# Altium project Drone.PrjPcb
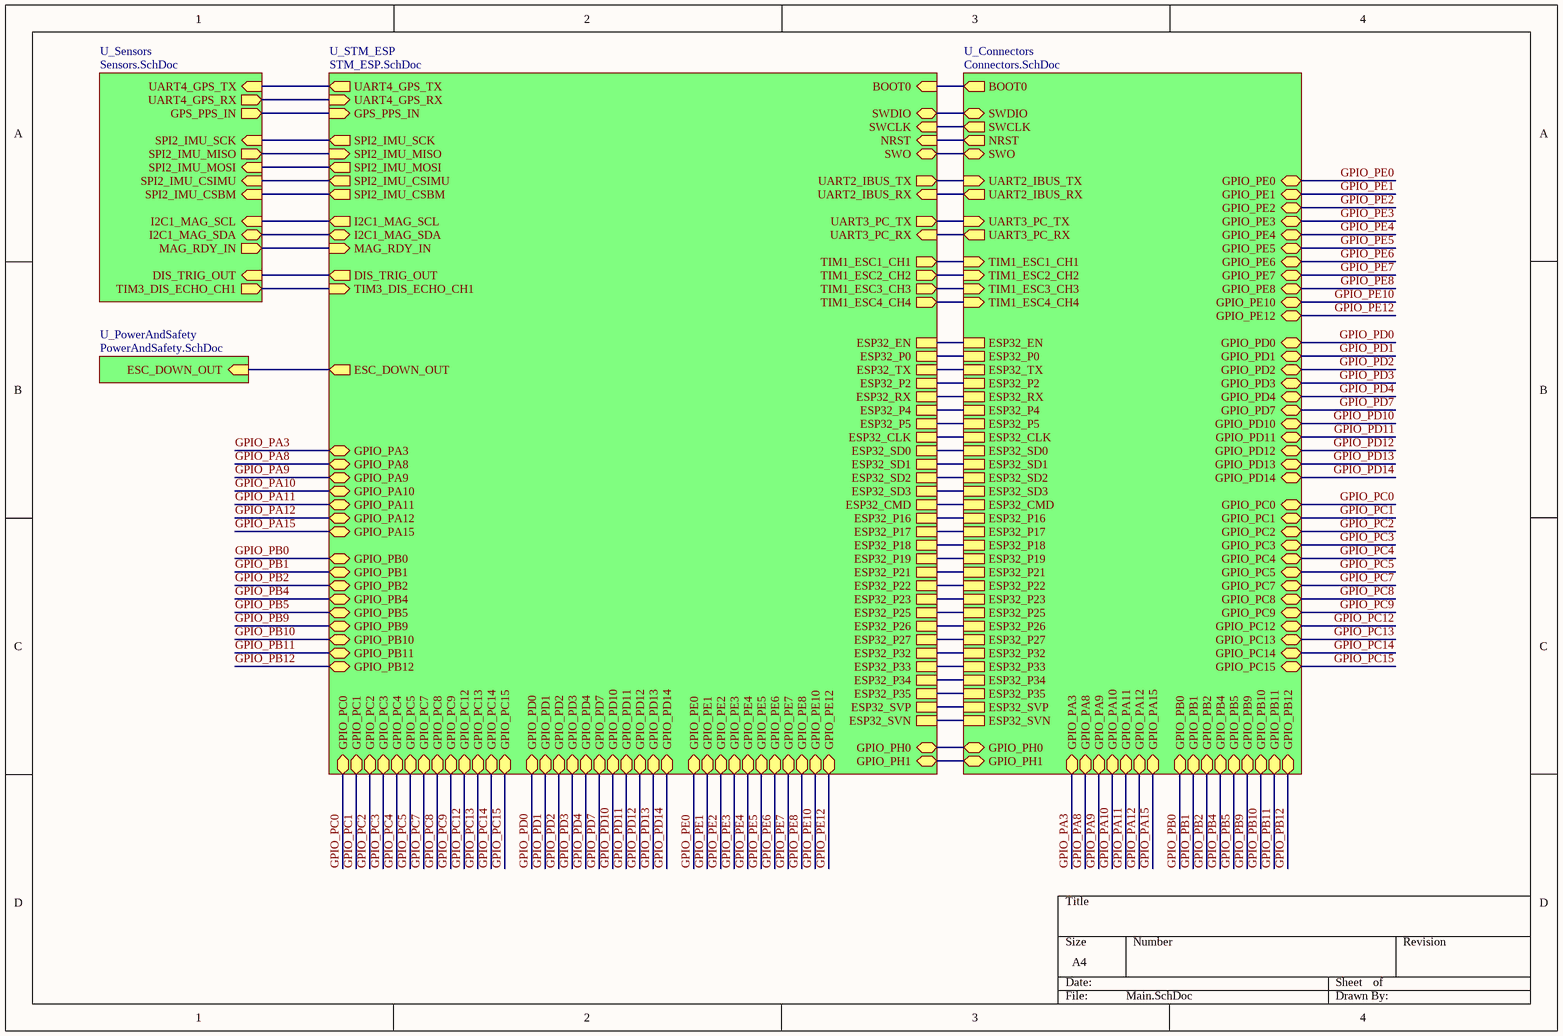
[diagram p0: Main.SchDoc]
5 sheets, 98 parts. Net scope: flat (ports and power ports of the same name join across sheets).
Board file: Main.PcbDoc
Sheets:
  Main.SchDoc
    U_STM_ESP = STM_ESP.SchDoc
    U_Sensors = Sensors.SchDoc
    U_Connectors = Connectors.SchDoc
    U_PowerAndSafety = PowerAndSafety.SchDoc

## Sheet Main.SchDoc
size A4; SheetNumber: 1; SheetTotal: 5

### Sub-sheets
U_Connectors = Connectors.SchDoc: ESP32_EN, ESP32_SVP, ESP32_SVN, ESP32_P34, ESP32_P35, ESP32_P32, ESP32_P33, ESP32_P25, ESP32_P26, ESP32_P27, ESP32_SD2, ESP32_SD3, ESP32_CMD, ESP32_P23, ESP32_P22, ESP32_TX, ESP32_RX, ESP32_P21, ESP32_P19, ESP32_P18, ESP32_P5, ESP32_P17, ESP32_P16, ESP32_P4, ESP32_P0, ESP32_SD1, ESP32_SD0, ESP32_CLK, ESP32_P2, GPIO_PA3 (bidir), GPIO_PA8 (bidir), GPIO_PA11 (bidir), GPIO_PA12 (bidir), GPIO_PA15 (bidir), GPIO_PB0 (bidir), GPIO_PB1 (bidir), GPIO_PB4 (bidir), GPIO_PB5 (bidir), GPIO_PB10 (bidir), GPIO_PC2 (bidir), GPIO_PC3 (bidir), GPIO_PH0 (bidir), GPIO_PH1 (bidir), GPIO_PB9 (bidir), BOOT0 (out), NRST (out), SWO (bidir), TIM1_ESC1_CH1 (in), TIM1_ESC2_CH2 (in), TIM1_ESC3_CH3 (in), TIM1_ESC4_CH4 (in), UART2_IBUS_TX (in), UART2_IBUS_RX (out), GPIO_PA9 (bidir), GPIO_PC15 (bidir), GPIO_PB2 (bidir), GPIO_PB11 (bidir), GPIO_PB12 (bidir), GPIO_PD0 (bidir), GPIO_PD1 (bidir), GPIO_PD2 (bidir), GPIO_PD3 (bidir), GPIO_PD4 (bidir), GPIO_PD7 (bidir), GPIO_PD10 (bidir), GPIO_PD11 (bidir), GPIO_PD12 (bidir), GPIO_PD13 (bidir), GPIO_PD14 (bidir), GPIO_PE0 (bidir), GPIO_PE5 (bidir), GPIO_PE6 (bidir), GPIO_PE7 (bidir), GPIO_PE8 (bidir), GPIO_PE10 (bidir), GPIO_PE12 (bidir), GPIO_PC0 (bidir), GPIO_PC1 (bidir), GPIO_PC4 (bidir), GPIO_PC5 (bidir), GPIO_PC7 (bidir), GPIO_PC8 (bidir), GPIO_PC9 (bidir), GPIO_PC12 (bidir), GPIO_PC13 (bidir), GPIO_PC14 (bidir), GPIO_PE1 (bidir), GPIO_PE2 (bidir), GPIO_PE3 (bidir), GPIO_PE4 (bidir), SWDIO (bidir), SWCLK (out), UART3_PC_TX (in), UART3_PC_RX (out), GPIO_PA10 (bidir)
U_PowerAndSafety = PowerAndSafety.SchDoc: ESC_DOWN_OUT (in)
U_Sensors = Sensors.SchDoc: UART4_GPS_TX (in), UART4_GPS_RX (out), GPS_PPS_IN (out), SPI2_IMU_CSIMU (in), SPI2_IMU_SCK (in), SPI2_IMU_MISO (out), SPI2_IMU_MOSI (in), SPI2_IMU_CSBM (in), I2C1_MAG_SCL (in), I2C1_MAG_SDA (bidir), MAG_RDY_IN (out), DIS_TRIG_OUT (in), TIM3_DIS_ECHO_CH1 (out)
U_STM_ESP = STM_ESP.SchDoc: GPIO_PA3 (bidir), GPIO_PA8 (bidir), GPIO_PB9 (bidir), GPIO_PB10 (bidir), BOOT0 (in), NRST (in), GPIO_PA11 (bidir), GPIO_PA12 (bidir), GPIO_PA15 (bidir), GPIO_PB0 (bidir), GPIO_PB1 (bidir), GPIO_PB4 (bidir), GPIO_PB5 (bidir), GPIO_PC2 (bidir), GPIO_PC3 (bidir), GPIO_PH0 (bidir), GPIO_PH1 (bidir), ESP32_EN, ESP32_SVP, ESP32_SVN, ESP32_P34, ESP32_P35, ESP32_P32, ESP32_P33, ESP32_P25, ESP32_P26, ESP32_P27, ESP32_SD2, ESP32_SD3, ESP32_CMD, ESP32_P23, ESP32_P22, ESP32_TX, ESP32_RX, ESP32_P21, ESP32_P19, ESP32_P18, ESP32_P5, ESP32_P17, ESP32_P16, ESP32_P4, ESP32_P0, ESP32_SD1, ESP32_SD0, ESP32_CLK, ESP32_P2, SWO (bidir), UART4_GPS_TX (out), UART4_GPS_RX (in), I2C1_MAG_SCL (out), I2C1_MAG_SDA (bidir), SPI2_IMU_SCK (out), SPI2_IMU_MISO (in), SPI2_IMU_MOSI (out), GPS_PPS_IN (in), SPI2_IMU_CSIMU (out), SPI2_IMU_CSBM (out), MAG_RDY_IN (in), TIM1_ESC1_CH1 (out), TIM1_ESC2_CH2 (out), TIM1_ESC3_CH3 (out), TIM1_ESC4_CH4 (out), ESC_DOWN_OUT (out), SWDIO (bidir), SWCLK (in), UART3_PC_TX (out), UART3_PC_RX (in), DIS_TRIG_OUT (out), TIM3_DIS_ECHO_CH1 (in), GPIO_PA9 (bidir), GPIO_PA10 (bidir), GPIO_PC0 (bidir), GPIO_PC1 (bidir), GPIO_PC4 (bidir), GPIO_PC5 (bidir), GPIO_PC7 (bidir), GPIO_PC8 (bidir), GPIO_PC9 (bidir), GPIO_PC12 (bidir), GPIO_PC13 (bidir), GPIO_PC14 (bidir), GPIO_PC15 (bidir), GPIO_PB2 (bidir), GPIO_PB11 (bidir), GPIO_PB12 (bidir), GPIO_PD0 (bidir), GPIO_PD1 (bidir), GPIO_PD2 (bidir), GPIO_PD3 (bidir), GPIO_PD4 (bidir), GPIO_PD7 (bidir), GPIO_PD10 (bidir), GPIO_PD11 (bidir), GPIO_PD12 (bidir), GPIO_PD13 (bidir), GPIO_PD14 (bidir), GPIO_PE0 (bidir), GPIO_PE1 (bidir), GPIO_PE2 (bidir), GPIO_PE3 (bidir), GPIO_PE4 (bidir), GPIO_PE5 (bidir), GPIO_PE6 (bidir), GPIO_PE7 (bidir), GPIO_PE8 (bidir), GPIO_PE10 (bidir), GPIO_PE12 (bidir), UART2_IBUS_TX (out), UART2_IBUS_RX (in)

### Nets
GPIO_PA3: sheet U_STM_ESP/GPIO_PA3, sheet U_Connectors/GPIO_PA3
GPIO_PA8: sheet U_STM_ESP/GPIO_PA8, sheet U_Connectors/GPIO_PA8
GPIO_PA9: sheet U_STM_ESP/GPIO_PA9, sheet U_Connectors/GPIO_PA9
GPIO_PA10: sheet U_STM_ESP/GPIO_PA10, sheet U_Connectors/GPIO_PA10
GPIO_PA11: sheet U_STM_ESP/GPIO_PA11, sheet U_Connectors/GPIO_PA11
GPIO_PA12: sheet U_STM_ESP/GPIO_PA12, sheet U_Connectors/GPIO_PA12
GPIO_PA15: sheet U_STM_ESP/GPIO_PA15, sheet U_Connectors/GPIO_PA15
GPIO_PB0: sheet U_STM_ESP/GPIO_PB0, sheet U_Connectors/GPIO_PB0
GPIO_PB1: sheet U_STM_ESP/GPIO_PB1, sheet U_Connectors/GPIO_PB1
GPIO_PB2: sheet U_STM_ESP/GPIO_PB2, sheet U_Connectors/GPIO_PB2
GPIO_PB4: sheet U_STM_ESP/GPIO_PB4, sheet U_Connectors/GPIO_PB4
GPIO_PB5: sheet U_STM_ESP/GPIO_PB5, sheet U_Connectors/GPIO_PB5
GPIO_PB9: sheet U_STM_ESP/GPIO_PB9, sheet U_Connectors/GPIO_PB9
GPIO_PB10: sheet U_STM_ESP/GPIO_PB10, sheet U_Connectors/GPIO_PB10
GPIO_PB11: sheet U_STM_ESP/GPIO_PB11, sheet U_Connectors/GPIO_PB11
GPIO_PB12: sheet U_STM_ESP/GPIO_PB12, sheet U_Connectors/GPIO_PB12
GPIO_PC0: sheet U_STM_ESP/GPIO_PC0, sheet U_Connectors/GPIO_PC0
GPIO_PC1: sheet U_STM_ESP/GPIO_PC1, sheet U_Connectors/GPIO_PC1
GPIO_PC2: sheet U_STM_ESP/GPIO_PC2, sheet U_Connectors/GPIO_PC2
GPIO_PC3: sheet U_STM_ESP/GPIO_PC3, sheet U_Connectors/GPIO_PC3
GPIO_PC4: sheet U_STM_ESP/GPIO_PC4, sheet U_Connectors/GPIO_PC4
GPIO_PC5: sheet U_STM_ESP/GPIO_PC5, sheet U_Connectors/GPIO_PC5
GPIO_PC7: sheet U_STM_ESP/GPIO_PC7, sheet U_Connectors/GPIO_PC7
GPIO_PC8: sheet U_STM_ESP/GPIO_PC8, sheet U_Connectors/GPIO_PC8
GPIO_PC9: sheet U_STM_ESP/GPIO_PC9, sheet U_Connectors/GPIO_PC9
GPIO_PC12: sheet U_STM_ESP/GPIO_PC12, sheet U_Connectors/GPIO_PC12
GPIO_PC13: sheet U_STM_ESP/GPIO_PC13, sheet U_Connectors/GPIO_PC13
GPIO_PC14: sheet U_STM_ESP/GPIO_PC14, sheet U_Connectors/GPIO_PC14
GPIO_PC15: sheet U_STM_ESP/GPIO_PC15, sheet U_Connectors/GPIO_PC15
GPIO_PD0: sheet U_STM_ESP/GPIO_PD0, sheet U_Connectors/GPIO_PD0
GPIO_PD1: sheet U_STM_ESP/GPIO_PD1, sheet U_Connectors/GPIO_PD1
GPIO_PD2: sheet U_STM_ESP/GPIO_PD2, sheet U_Connectors/GPIO_PD2
GPIO_PD3: sheet U_STM_ESP/GPIO_PD3, sheet U_Connectors/GPIO_PD3
GPIO_PD4: sheet U_STM_ESP/GPIO_PD4, sheet U_Connectors/GPIO_PD4
GPIO_PD7: sheet U_STM_ESP/GPIO_PD7, sheet U_Connectors/GPIO_PD7
GPIO_PD10: sheet U_STM_ESP/GPIO_PD10, sheet U_Connectors/GPIO_PD10
GPIO_PD11: sheet U_STM_ESP/GPIO_PD11, sheet U_Connectors/GPIO_PD11
GPIO_PD12: sheet U_STM_ESP/GPIO_PD12, sheet U_Connectors/GPIO_PD12
GPIO_PD13: sheet U_STM_ESP/GPIO_PD13, sheet U_Connectors/GPIO_PD13
GPIO_PD14: sheet U_STM_ESP/GPIO_PD14, sheet U_Connectors/GPIO_PD14
GPIO_PE0: sheet U_STM_ESP/GPIO_PE0, sheet U_Connectors/GPIO_PE0
GPIO_PE1: sheet U_STM_ESP/GPIO_PE1, sheet U_Connectors/GPIO_PE1
GPIO_PE2: sheet U_STM_ESP/GPIO_PE2, sheet U_Connectors/GPIO_PE2
GPIO_PE3: sheet U_STM_ESP/GPIO_PE3, sheet U_Connectors/GPIO_PE3
GPIO_PE4: sheet U_STM_ESP/GPIO_PE4, sheet U_Connectors/GPIO_PE4
GPIO_PE5: sheet U_STM_ESP/GPIO_PE5, sheet U_Connectors/GPIO_PE5
GPIO_PE6: sheet U_STM_ESP/GPIO_PE6, sheet U_Connectors/GPIO_PE6
GPIO_PE7: sheet U_STM_ESP/GPIO_PE7, sheet U_Connectors/GPIO_PE7
GPIO_PE8: sheet U_STM_ESP/GPIO_PE8, sheet U_Connectors/GPIO_PE8
GPIO_PE10: sheet U_STM_ESP/GPIO_PE10, sheet U_Connectors/GPIO_PE10
GPIO_PE12: sheet U_STM_ESP/GPIO_PE12, sheet U_Connectors/GPIO_PE12
(unnamed): sheet U_STM_ESP/BOOT0, sheet U_Connectors/BOOT0
(unnamed): sheet U_STM_ESP/NRST, sheet U_Connectors/NRST
(unnamed): sheet U_STM_ESP/GPIO_PH0, sheet U_Connectors/GPIO_PH0
(unnamed): sheet U_STM_ESP/GPIO_PH1, sheet U_Connectors/GPIO_PH1
(unnamed): sheet U_STM_ESP/ESP32_EN, sheet U_Connectors/ESP32_EN
(unnamed): sheet U_STM_ESP/ESP32_SVP, sheet U_Connectors/ESP32_SVP
(unnamed): sheet U_STM_ESP/ESP32_SVN, sheet U_Connectors/ESP32_SVN
(unnamed): sheet U_STM_ESP/ESP32_P34, sheet U_Connectors/ESP32_P34
(unnamed): sheet U_STM_ESP/ESP32_P35, sheet U_Connectors/ESP32_P35
(unnamed): sheet U_STM_ESP/ESP32_P32, sheet U_Connectors/ESP32_P32
(unnamed): sheet U_STM_ESP/ESP32_P33, sheet U_Connectors/ESP32_P33
(unnamed): sheet U_STM_ESP/ESP32_P25, sheet U_Connectors/ESP32_P25
(unnamed): sheet U_STM_ESP/ESP32_P26, sheet U_Connectors/ESP32_P26
(unnamed): sheet U_STM_ESP/ESP32_P27, sheet U_Connectors/ESP32_P27
(unnamed): sheet U_STM_ESP/ESP32_SD2, sheet U_Connectors/ESP32_SD2
(unnamed): sheet U_STM_ESP/ESP32_SD3, sheet U_Connectors/ESP32_SD3
(unnamed): sheet U_STM_ESP/ESP32_CMD, sheet U_Connectors/ESP32_CMD
(unnamed): sheet U_STM_ESP/ESP32_P23, sheet U_Connectors/ESP32_P23
(unnamed): sheet U_STM_ESP/ESP32_P22, sheet U_Connectors/ESP32_P22
(unnamed): sheet U_STM_ESP/ESP32_TX, sheet U_Connectors/ESP32_TX
(unnamed): sheet U_STM_ESP/ESP32_RX, sheet U_Connectors/ESP32_RX
(unnamed): sheet U_STM_ESP/ESP32_P21, sheet U_Connectors/ESP32_P21
(unnamed): sheet U_STM_ESP/ESP32_P19, sheet U_Connectors/ESP32_P19
(unnamed): sheet U_STM_ESP/ESP32_P18, sheet U_Connectors/ESP32_P18
(unnamed): sheet U_STM_ESP/ESP32_P5, sheet U_Connectors/ESP32_P5
(unnamed): sheet U_STM_ESP/ESP32_P17, sheet U_Connectors/ESP32_P17
(unnamed): sheet U_STM_ESP/ESP32_P16, sheet U_Connectors/ESP32_P16
(unnamed): sheet U_STM_ESP/ESP32_P4, sheet U_Connectors/ESP32_P4
(unnamed): sheet U_STM_ESP/ESP32_P0, sheet U_Connectors/ESP32_P0
(unnamed): sheet U_STM_ESP/ESP32_SD1, sheet U_Connectors/ESP32_SD1
(unnamed): sheet U_STM_ESP/ESP32_SD0, sheet U_Connectors/ESP32_SD0
(unnamed): sheet U_STM_ESP/ESP32_CLK, sheet U_Connectors/ESP32_CLK
(unnamed): sheet U_STM_ESP/ESP32_P2, sheet U_Connectors/ESP32_P2
(unnamed): sheet U_STM_ESP/SWO, sheet U_Connectors/SWO
(unnamed): sheet U_STM_ESP/UART4_GPS_TX, sheet U_Sensors/UART4_GPS_TX
(unnamed): sheet U_STM_ESP/UART4_GPS_RX, sheet U_Sensors/UART4_GPS_RX
(unnamed): sheet U_STM_ESP/I2C1_MAG_SCL, sheet U_Sensors/I2C1_MAG_SCL
(unnamed): sheet U_STM_ESP/I2C1_MAG_SDA, sheet U_Sensors/I2C1_MAG_SDA
(unnamed): sheet U_STM_ESP/SPI2_IMU_SCK, sheet U_Sensors/SPI2_IMU_SCK
(unnamed): sheet U_STM_ESP/SPI2_IMU_MISO, sheet U_Sensors/SPI2_IMU_MISO
(unnamed): sheet U_STM_ESP/SPI2_IMU_MOSI, sheet U_Sensors/SPI2_IMU_MOSI
(unnamed): sheet U_STM_ESP/GPS_PPS_IN, sheet U_Sensors/GPS_PPS_IN
(unnamed): sheet U_STM_ESP/SPI2_IMU_CSIMU, sheet U_Sensors/SPI2_IMU_CSIMU
(unnamed): sheet U_STM_ESP/SPI2_IMU_CSBM, sheet U_Sensors/SPI2_IMU_CSBM
(unnamed): sheet U_STM_ESP/MAG_RDY_IN, sheet U_Sensors/MAG_RDY_IN
(unnamed): sheet U_STM_ESP/TIM1_ESC1_CH1, sheet U_Connectors/TIM1_ESC1_CH1
(unnamed): sheet U_STM_ESP/TIM1_ESC2_CH2, sheet U_Connectors/TIM1_ESC2_CH2
(unnamed): sheet U_STM_ESP/TIM1_ESC3_CH3, sheet U_Connectors/TIM1_ESC3_CH3
(unnamed): sheet U_STM_ESP/TIM1_ESC4_CH4, sheet U_Connectors/TIM1_ESC4_CH4
(unnamed): sheet U_STM_ESP/ESC_DOWN_OUT, sheet U_PowerAndSafety/ESC_DOWN_OUT
(unnamed): sheet U_STM_ESP/SWDIO, sheet U_Connectors/SWDIO
(unnamed): sheet U_STM_ESP/SWCLK, sheet U_Connectors/SWCLK
(unnamed): sheet U_STM_ESP/UART3_PC_TX, sheet U_Connectors/UART3_PC_TX
(unnamed): sheet U_STM_ESP/UART3_PC_RX, sheet U_Connectors/UART3_PC_RX
(unnamed): sheet U_STM_ESP/DIS_TRIG_OUT, sheet U_Sensors/DIS_TRIG_OUT
(unnamed): sheet U_STM_ESP/TIM3_DIS_ECHO_CH1, sheet U_Sensors/TIM3_DIS_ECHO_CH1
(unnamed): sheet U_STM_ESP/UART2_IBUS_TX, sheet U_Connectors/UART2_IBUS_TX
(unnamed): sheet U_STM_ESP/UART2_IBUS_RX, sheet U_Connectors/UART2_IBUS_RX

## Sheet STM_ESP.SchDoc
size A4; SheetNumber: 2; SheetTotal: 5
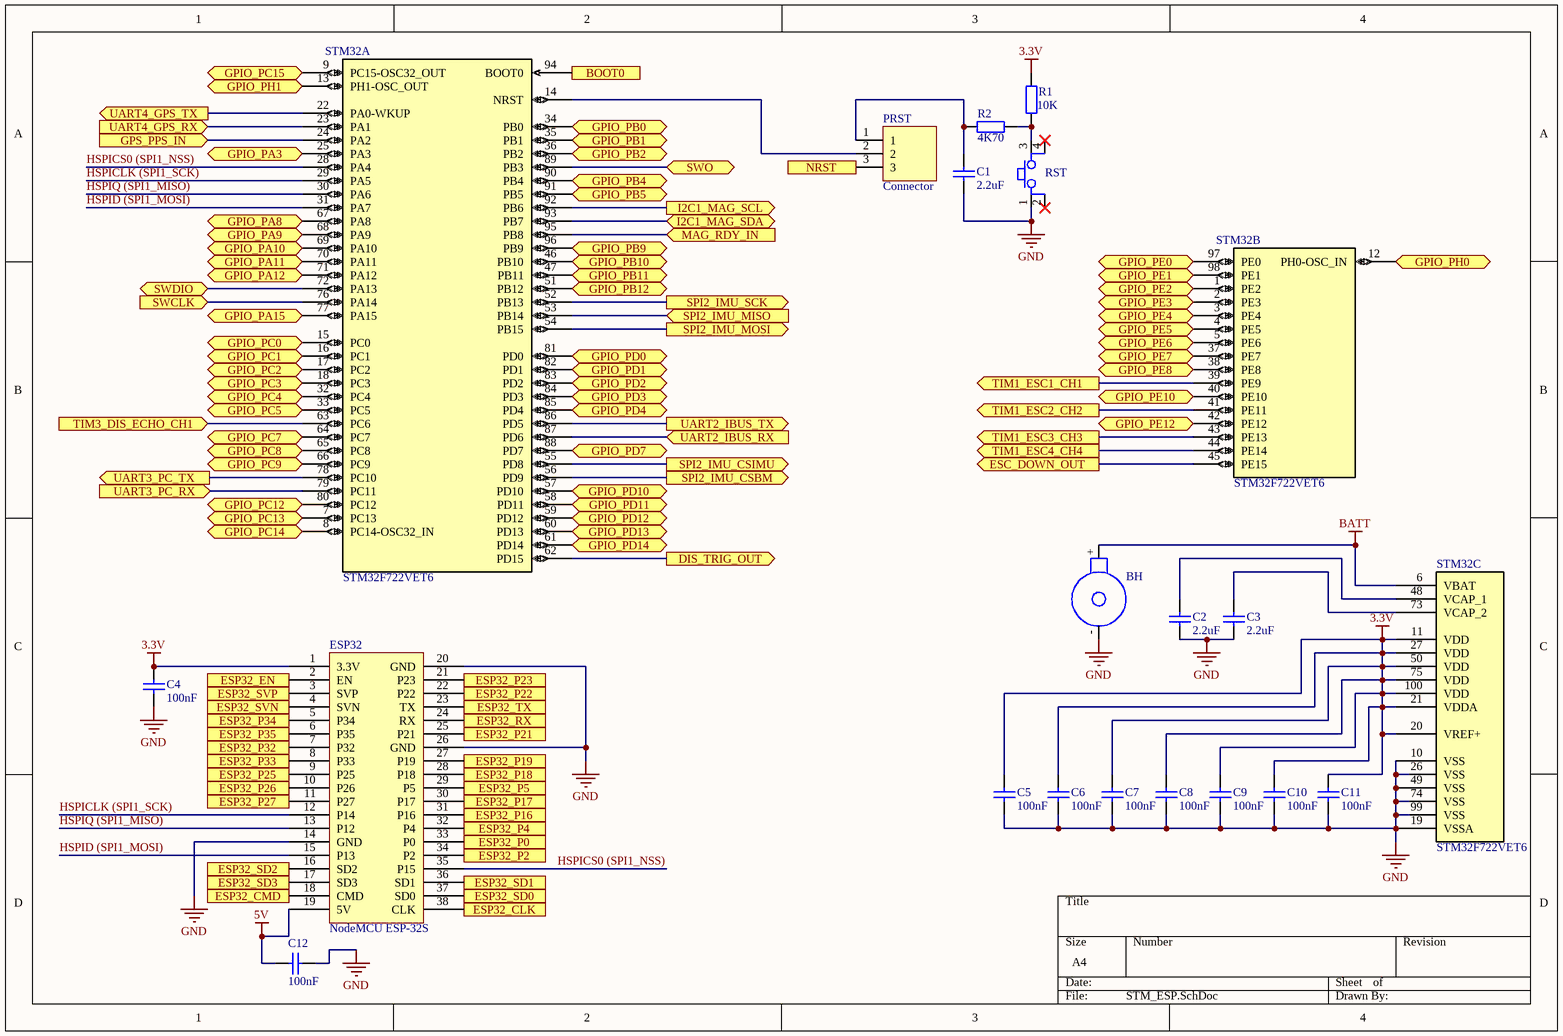
[diagram p1: STM_ESP.SchDoc]

### Parts
BH  Battery Holder  [ONLAB_ELEMTARTO]  (value not drawn)
C1  2.2uF  [FP_0805_CAP_085]
C2  2.2uF  [FP_0805_CAP_085]
C3  2.2uF  [FP_0805_CAP_085]
C4  100nF  [FP_0805_CAP_085]
C5  100nF  [FP_0805_CAP_085]
C6  100nF  [FP_0805_CAP_085]
C7  100nF  [FP_0805_CAP_085]
C8  100nF  [FP_0805_CAP_085]
C9  100nF  [FP_0805_CAP_085]
C10  100nF  [FP_0805_CAP_085]
C11  100nF  [FP_0805_CAP_085]
C12  100nF  [FP_0805_CAP_085]
ESP32  NodeMCU ESP-32S  [ESP32_NODEMCU-32S]
PRST  Connector  [FP_CONN3_TUSKE_254MM]
R1  10K  [FP_0805_RES]
R2  4K70  [FP_0805_RES]
RST  Button  [FP_BTN_SMD]  (value not drawn)
STM32  STM32F722VET6  [LQFP100-14x14mm]  (parts A,B,C of 3)

### Ports
BOOT0 (in), DIS_TRIG_OUT (out), ESC_DOWN_OUT (out), ESP32_CLK, ESP32_CMD, ESP32_EN, ESP32_P0, ESP32_P2, ESP32_P4, ESP32_P5, ESP32_P16, ESP32_P17, ESP32_P18, ESP32_P19, ESP32_P21, ESP32_P22, ESP32_P23, ESP32_P25, ESP32_P26, ESP32_P27, ESP32_P32, ESP32_P33, ESP32_P34, ESP32_P35, ESP32_RX, ESP32_SD0, ESP32_SD1, ESP32_SD2, ESP32_SD3, ESP32_SVN, ESP32_SVP, ESP32_TX, GPIO_PA3 (bidir), GPIO_PA8 (bidir), GPIO_PA9 (bidir), GPIO_PA10 (bidir), GPIO_PA11 (bidir), GPIO_PA12 (bidir), GPIO_PA15 (bidir), GPIO_PB0 (bidir), GPIO_PB1 (bidir), GPIO_PB2 (bidir), GPIO_PB4 (bidir), GPIO_PB5 (bidir), GPIO_PB9 (bidir), GPIO_PB10 (bidir), GPIO_PB11 (bidir), GPIO_PB12 (bidir), GPIO_PC0 (bidir), GPIO_PC1 (bidir), GPIO_PC2 (bidir), GPIO_PC3 (bidir), GPIO_PC4 (bidir), GPIO_PC5 (bidir), GPIO_PC7 (bidir), GPIO_PC8 (bidir), GPIO_PC9 (bidir), GPIO_PC12 (bidir), GPIO_PC13 (bidir), GPIO_PC14 (bidir), GPIO_PC15 (bidir), GPIO_PD0 (bidir), GPIO_PD1 (bidir), GPIO_PD2 (bidir), GPIO_PD3 (bidir), GPIO_PD4 (bidir), GPIO_PD7 (bidir), GPIO_PD10 (bidir), GPIO_PD11 (bidir), GPIO_PD12 (bidir), GPIO_PD13 (bidir), GPIO_PD14 (bidir), GPIO_PE0 (bidir), GPIO_PE1 (bidir), GPIO_PE2 (bidir), GPIO_PE3 (bidir), GPIO_PE4 (bidir), GPIO_PE5 (bidir), GPIO_PE6 (bidir), GPIO_PE7 (bidir), GPIO_PE8 (bidir), GPIO_PE10 (bidir), GPIO_PE12 (bidir), GPIO_PH0 (bidir), GPIO_PH1 (bidir), GPS_PPS_IN (in), I2C1_MAG_SCL (out), I2C1_MAG_SDA (bidir), MAG_RDY_IN (in), NRST (in), SPI2_IMU_CSBM (out), SPI2_IMU_CSIMU (out), SPI2_IMU_MISO (in), SPI2_IMU_MOSI (out), SPI2_IMU_SCK (out), SWCLK (in), SWDIO (bidir), SWO (bidir), TIM1_ESC1_CH1 (out), TIM1_ESC2_CH2 (out), TIM1_ESC3_CH3 (out), TIM1_ESC4_CH4 (out), TIM3_DIS_ECHO_CH1 (in), UART2_IBUS_RX (in), UART2_IBUS_TX (out), UART3_PC_RX (in), UART3_PC_TX (out), UART4_GPS_RX (in), UART4_GPS_TX (out)

### Nets
3.3V: C4.2 C5.1 C6.1 C7.1 C8.1 C9.1 C10.1 C11.1 ESP32.1(3.3V) R1.2 STM32.11(VDD) STM32.20(VREF+) STM32.21(VDDA) STM32.27(VDD) STM32.50(VDD) STM32.75(VDD) STM32.100(VDD)
5V: C12.2 ESP32.19(5V)
BATT: BH.+ STM32.6(VBAT)
GND: BH.- C1.1 C2.1 C3.1 C4.1 C5.2 C6.2 C7.2 C8.2 C9.2 C10.2 C11.2 C12.1 ESP32.14(GND) ESP32.20(GND) ESP32.26(GND) RST.1 STM32.10(VSS) STM32.19(VSSA) STM32.26(VSS) STM32.49(VSS) STM32.74(VSS) STM32.99(VSS)
HSPICLK (SPI1_SCK): ESP32.12(P14) STM32.29(PA5)
HSPICS0 (SPI1_NSS): ESP32.35(P15) STM32.28(PA4)
HSPID (SPI1_MOSI): ESP32.15(P13) STM32.31(PA7)
HSPIQ (SPI1_MISO): ESP32.13(P12) STM32.30(PA6)
NRST: PRST.3 ; port NRST
SWCLK: STM32.76(PA14) ; port SWCLK
SWDIO: STM32.72(PA13) ; port SWDIO
SWO: STM32.89(PB3) ; port SWO
UART3_PC_RX: STM32.79(PC11) ; port UART3_PC_RX
UART3_PC_TX: STM32.78(PC10) ; port UART3_PC_TX
NetC1_2: C1.2 PRST.1 R2.1
NetC2_2: C2.2 STM32.48(VCAP_1)
NetC3_2: C3.2 STM32.73(VCAP_2)
NetESC1_3: STM32.39(PE9) ; port TIM1_ESC1_CH1
NetESC2_3: STM32.41(PE11) ; port TIM1_ESC2_CH2
NetESC3_3: STM32.43(PE13) ; port TIM1_ESC3_CH3
NetESC4_3: STM32.44(PE14) ; port TIM1_ESC4_CH4
NetESP32_2: ESP32.2(EN) ; port ESP32_EN
NetESP32_3: ESP32.3(SVP) ; port ESP32_SVP
NetESP32_4: ESP32.4(SVN) ; port ESP32_SVN
NetESP32_5: ESP32.5(P34) ; port ESP32_P34
NetESP32_6: ESP32.6(P35) ; port ESP32_P35
NetESP32_7: ESP32.7(P32) ; port ESP32_P32
NetESP32_8: ESP32.8(P33) ; port ESP32_P33
NetESP32_9: ESP32.9(P25) ; port ESP32_P25
NetESP32_10: ESP32.10(P26) ; port ESP32_P26
NetESP32_11: ESP32.11(P27) ; port ESP32_P27
NetESP32_16: ESP32.16(SD2) ; port ESP32_SD2
NetESP32_17: ESP32.17(SD3) ; port ESP32_SD3
NetESP32_18: ESP32.18(CMD) ; port ESP32_CMD
NetESP32_21: ESP32.21(P23) ; port ESP32_P23
NetESP32_22: ESP32.22(P22) ; port ESP32_P22
NetESP32_23: ESP32.23(TX) ; port ESP32_TX
NetESP32_24: ESP32.24(RX) ; port ESP32_RX
NetESP32_25: ESP32.25(P21) ; port ESP32_P21
NetESP32_27: ESP32.27(P19) ; port ESP32_P19
NetESP32_28: ESP32.28(P18) ; port ESP32_P18
NetESP32_29: ESP32.29(P5) ; port ESP32_P5
NetESP32_30: ESP32.30(P17) ; port ESP32_P17
NetESP32_31: ESP32.31(P16) ; port ESP32_P16
NetESP32_32: ESP32.32(P4) ; port ESP32_P4
NetESP32_33: ESP32.33(P0) ; port ESP32_P0
NetESP32_34: ESP32.34(P2) ; port ESP32_P2
NetESP32_36: ESP32.36(SD1) ; port ESP32_SD1
NetESP32_37: ESP32.37(SD0) ; port ESP32_SD0
NetESP32_38: ESP32.38(CLK) ; port ESP32_CLK
NetGPS_3: STM32.22(PA0-WKUP) ; port UART4_GPS_TX
NetGPS_4: STM32.23(PA1) ; port UART4_GPS_RX
NetGPS_5: STM32.24(PA2) ; port GPS_PPS_IN
NetIMU_4: STM32.52(PB13) ; port SPI2_IMU_SCK
NetIMU_5: STM32.54(PB15) ; port SPI2_IMU_MOSI
NetIMU_6: STM32.53(PB14) ; port SPI2_IMU_MISO
NetIMU_7: STM32.55(PD8) ; port SPI2_IMU_CSIMU
NetIMU_8: STM32.56(PD9) ; port SPI2_IMU_CSBM
NetLC_3: STM32.62(PD15) ; port DIS_TRIG_OUT
NetLC_4: STM32.63(PC6) ; port TIM3_DIS_ECHO_CH1
NetMAG_3: STM32.92(PB6) ; port I2C1_MAG_SCL
NetMAG_4: STM32.93(PB7) ; port I2C1_MAG_SDA
NetMAG_5: STM32.95(PB8) ; port MAG_RDY_IN
NetPA1_1: STM32.25(PA3) ; port GPIO_PA3
NetPA1_2: STM32.67(PA8) ; port GPIO_PA8
NetPA1_3: STM32.68(PA9) ; port GPIO_PA9
NetPA1_4: STM32.69(PA10) ; port GPIO_PA10
NetPB1_1: STM32.70(PA11) ; port GPIO_PA11
NetPB1_2: STM32.71(PA12) ; port GPIO_PA12
NetPB1_3: STM32.77(PA15) ; port GPIO_PA15
NetPB1_4: STM32.34(PB0) ; port GPIO_PB0
NetPB2_1: STM32.35(PB1) ; port GPIO_PB1
NetPB2_2: STM32.36(PB2) ; port GPIO_PB2
NetPB2_3: STM32.90(PB4) ; port GPIO_PB4
NetPB2_4: STM32.91(PB5) ; port GPIO_PB5
NetPB3_1: STM32.96(PB9) ; port GPIO_PB9
NetPB3_2: STM32.46(PB10) ; port GPIO_PB10
NetPB3_3: STM32.47(PB11) ; port GPIO_PB11
NetPB3_4: STM32.51(PB12) ; port GPIO_PB12
NetPC1_1: STM32.15(PC0) ; port GPIO_PC0
NetPC1_2: STM32.16(PC1) ; port GPIO_PC1
NetPC1_3: STM32.17(PC2) ; port GPIO_PC2
NetPC1_4: STM32.18(PC3) ; port GPIO_PC3
NetPC2_1: STM32.32(PC4) ; port GPIO_PC4
NetPC2_2: STM32.33(PC5) ; port GPIO_PC5
NetPC2_3: STM32.64(PC7) ; port GPIO_PC7
NetPC2_4: STM32.65(PC8) ; port GPIO_PC8
NetPC3_1: STM32.66(PC9) ; port GPIO_PC9
NetPC3_2: STM32.80(PC12) ; port GPIO_PC12
NetPC3_3: STM32.7(PC13) ; port GPIO_PC13
NetPC3_4: STM32.8(PC14-OSC32_IN) ; port GPIO_PC14
NetPD1_1: STM32.9(PC15-OSC32_OUT) ; port GPIO_PC15
NetPD1_2: STM32.81(PD0) ; port GPIO_PD0
NetPD1_3: STM32.82(PD1) ; port GPIO_PD1
NetPD1_4: STM32.83(PD2) ; port GPIO_PD2
NetPD2_1: STM32.84(PD3) ; port GPIO_PD3
NetPD2_2: STM32.85(PD4) ; port GPIO_PD4
NetPD2_3: STM32.88(PD7) ; port GPIO_PD7
NetPD2_4: STM32.57(PD10) ; port GPIO_PD10
NetPD3_1: STM32.58(PD11) ; port GPIO_PD11
NetPD3_2: STM32.59(PD12) ; port GPIO_PD12
NetPD3_3: STM32.60(PD13) ; port GPIO_PD13
NetPD3_4: STM32.61(PD14) ; port GPIO_PD14
NetPE1_1: STM32.97(PE0) ; port GPIO_PE0
NetPE1_2: STM32.98(PE1) ; port GPIO_PE1
NetPE1_3: STM32.1(PE2) ; port GPIO_PE2
NetPE1_4: STM32.2(PE3) ; port GPIO_PE3
NetPE2_1: STM32.3(PE4) ; port GPIO_PE4
NetPE2_2: STM32.4(PE5) ; port GPIO_PE5
NetPE2_3: STM32.5(PE6) ; port GPIO_PE6
NetPE2_4: STM32.37(PE7) ; port GPIO_PE7
NetPE3_1: STM32.38(PE8) ; port GPIO_PE8
NetPE3_2: STM32.40(PE10) ; port GPIO_PE10
NetPE3_3: STM32.42(PE12) ; port GPIO_PE12
NetPH1_1: STM32.12(PH0-OSC_IN) ; port GPIO_PH0
NetPH1_2: STM32.13(PH1-OSC_OUT) ; port GPIO_PH1
NetPRST_2: PRST.2 STM32.14(NRST)
NetR1_1: R1.1 R2.2 RST.3
NetR3_2: STM32.94(BOOT0) ; port BOOT0
NetR9_2: STM32.45(PE15) ; port ESC_DOWN_OUT
NetSENS_3: STM32.86(PD5) ; port UART2_IBUS_TX
NetSERV_3: STM32.87(PD6) ; port UART2_IBUS_RX

Not connected (* = marked no-connect by the designer): RST 2* 4*

### Library data of the parts
BH = Battery Holder: ELEMTARTÓ 1x2032 BH2032-3P (T-T) NYÁK FEKVŐ /CR2032/
C1-C12 = CAP: Capacitor
  C1-C3: Value: 2.2uF
  C4-C12: Value: 100nF
ESP32 = NodeMCU ESP-32S: NodeMCU ESP32 Wireless & / Bluetooth Development Board
PRST = Connector_3pin: 3pin connector
R1 R2 = RES: Resistor
  R1: Value: 10K
  R2: Value: 4K70
RST = Button 4P: Push button
STM32 = STM32F722VET6: No Description Available; Mfr_Name: STMicroelectronics; RefDes: RefDes; Type: Type

## Sheet Sensors.SchDoc
size A4; SheetNumber: 3; SheetTotal: 5
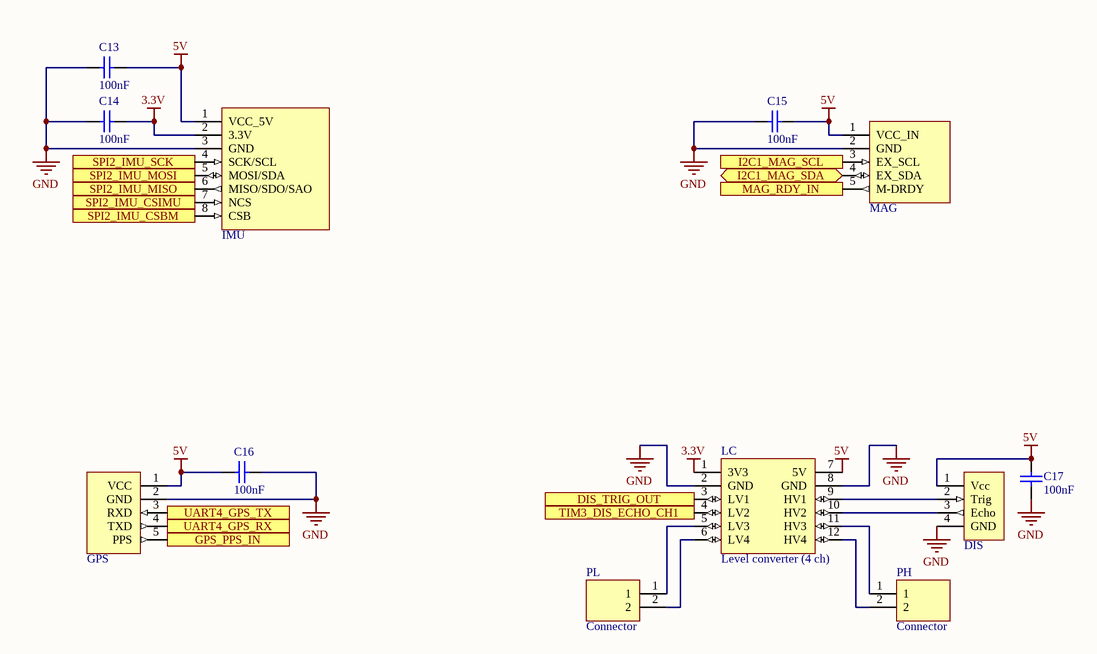
[diagram p2: Sensors.SchDoc]

### Parts
C13  100nF  [FP_0805_CAP_085]
C14  100nF  [FP_0805_CAP_085]
C15  100nF  [FP_0805_CAP_085]
C16  100nF  [FP_0805_CAP_085]
C17  100nF  [FP_0805_CAP_085]
DIS  Távolságérzékelő  [FP_CONN4_TUSKE_254MM]  (value not drawn)
GPS  GPS  [FP_CONN5_TUSKE_254MM]  (value not drawn)
IMU  IMU + Barométer  [GY-91]  (value not drawn)
LC  Level converter (4 ch)  [Level converter (4 ch)]
MAG  Iránytű, magnetométer  [GY-271]  (value not drawn)
PH  Connector  [FP_CONN2_TUSKE_254MM]
PL  Connector  [FP_CONN2_TUSKE_254MM]

### Ports
DIS_TRIG_OUT (in), GPS_PPS_IN (out), I2C1_MAG_SCL (in), I2C1_MAG_SDA (bidir), MAG_RDY_IN (out), SPI2_IMU_CSBM (in), SPI2_IMU_CSIMU (in), SPI2_IMU_MISO (out), SPI2_IMU_MOSI (in), SPI2_IMU_SCK (in), TIM3_DIS_ECHO_CH1 (out), UART4_GPS_RX (out), UART4_GPS_TX (in)

### Nets
3.3V: C14.2 IMU.2(3.3V) LC.1(3V3)
5V: C13.2 C15.2 C16.1 C17.2 DIS.1(Vcc) GPS.1(VCC) IMU.1(VCC_5V) LC.7(5V) MAG.1(VCC_IN)
GND: C13.1 C14.1 C15.1 C16.2 C17.1 DIS.4(GND) GPS.2(GND) IMU.3(GND) LC.2(GND) LC.8(GND) MAG.2(GND)
NetDIS_2: DIS.2(Trig) LC.9(HV1)
NetDIS_3: DIS.3(Echo) LC.10(HV2)
NetGPS_3: GPS.3(RXD) ; port UART4_GPS_TX
NetGPS_4: GPS.4(TXD) ; port UART4_GPS_RX
NetGPS_5: GPS.5(PPS) ; port GPS_PPS_IN
NetIMU_4: IMU.4(SCK/SCL) ; port SPI2_IMU_SCK
NetIMU_5: IMU.5(MOSI/SDA) ; port SPI2_IMU_MOSI
NetIMU_6: IMU.6(MISO/SDO/SAO) ; port SPI2_IMU_MISO
NetIMU_7: IMU.7(NCS) ; port SPI2_IMU_CSIMU
NetIMU_8: IMU.8(CSB) ; port SPI2_IMU_CSBM
NetLC_3: LC.3(LV1) ; port DIS_TRIG_OUT
NetLC_4: LC.4(LV2) ; port TIM3_DIS_ECHO_CH1
NetLC_5: LC.5(LV3) PL.1
NetLC_6: LC.6(LV4) PL.2
NetLC_11: LC.11(HV3) PH.1
NetLC_12: LC.12(HV4) PH.2
NetMAG_3: MAG.3(EX_SCL) ; port I2C1_MAG_SCL
NetMAG_4: MAG.4(EX_SDA) ; port I2C1_MAG_SDA
NetMAG_5: MAG.5(M-DRDY) ; port MAG_RDY_IN

### Library data of the parts
C13-C17 = CAP: Capacitor; Value: 100nF
DIS = HC-SR04-4P: Ultrahangos távolságérzékelő modul, 4P
GPS = NEO-7M-0-000: Ublox GPS modul EEPROM-mal C / AeroQuad-hoz, antennával NEO-7M 7N APM2.5 repülésvezérléshez
IMU = GY-91: 9DOF MPU9250 modul + BMP280, giroszkóp, gyorsulásmérő, iránytű, nyomásmérő, hőmérő, páratartalom mérő
LC = Level converter (4 ch): 4 channel level converter 3.3 <-> 5 V
MAG = GY-271: HMC5883L 3 tengelyes digitális iránytű (compass, magnetometer) I2C
PH PL = Connector_2pin: 2pin connector

## Sheet Connectors.SchDoc
size A4; SheetNumber: 4; SheetTotal: 5
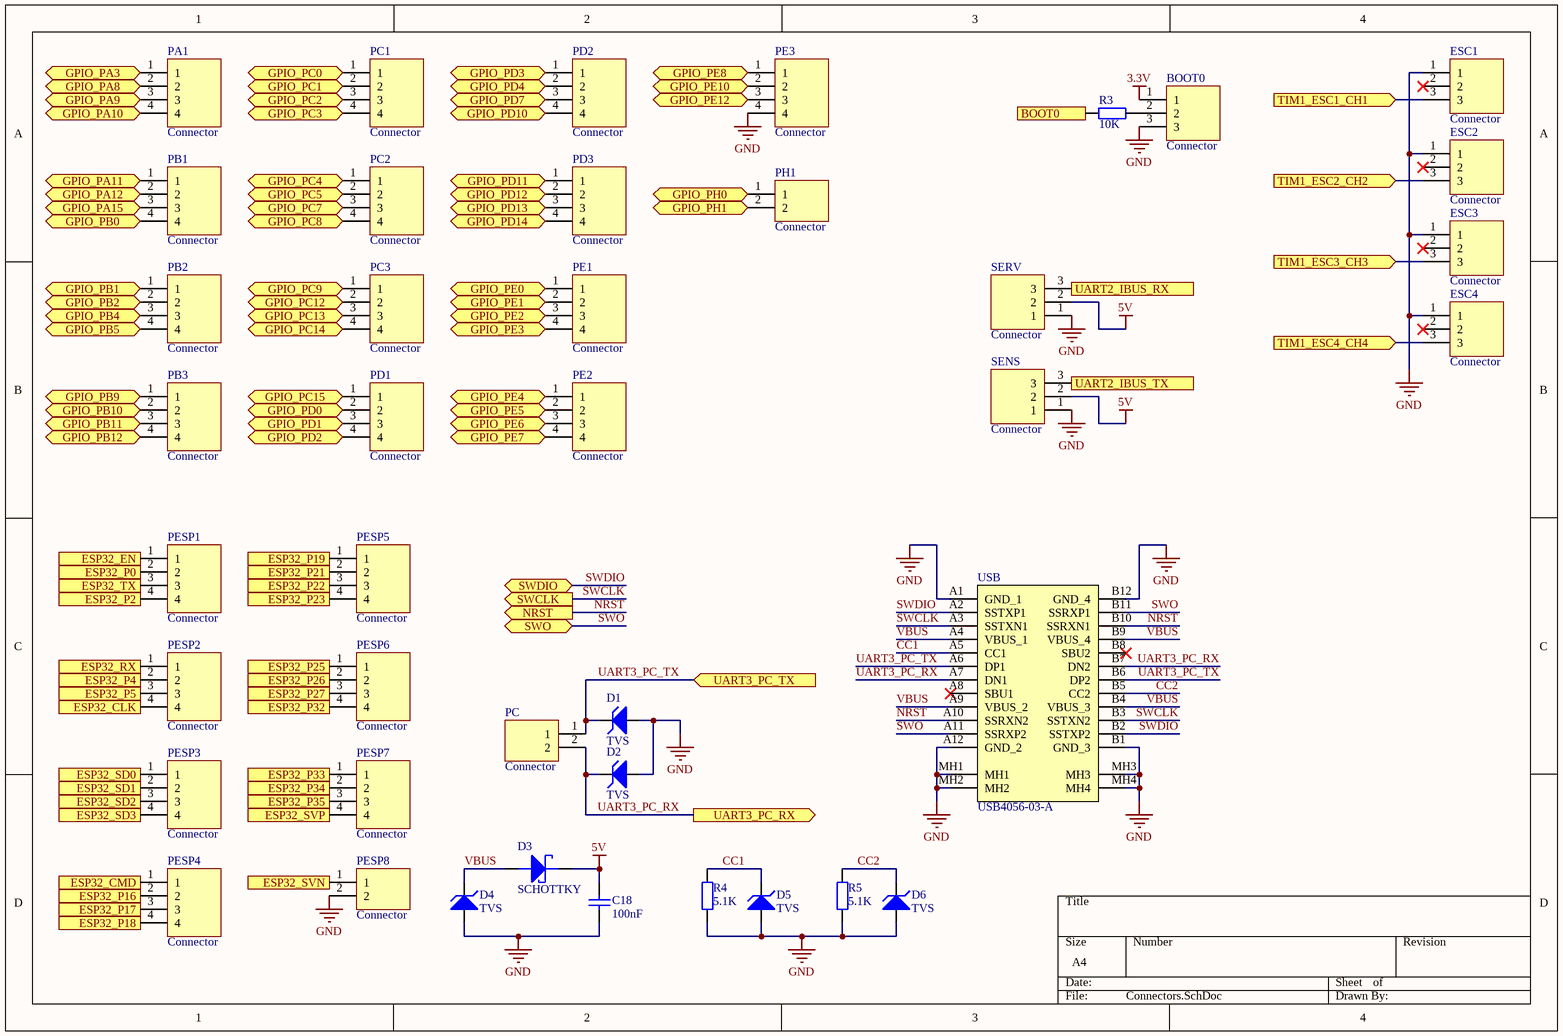
[diagram p3: Connectors.SchDoc]

### Parts
BOOT0  Connector  [FP_CONN3_TUSKE_254MM]
C18  100nF  [FP_0805_CAP_085]
D1  TVS  [FP_SMB]
D2  TVS  [FP_SMB]
D3  SCHOTTKY  [FP_SMA]
D4  TVS  [FP_SMB]
D5  TVS  [FP_SMB]
D6  TVS  [FP_SMB]
ESC1  Connector  [FP_CONN3_TUSKE_254MM]
ESC2  Connector  [FP_CONN3_TUSKE_254MM]
ESC3  Connector  [FP_CONN3_TUSKE_254MM]
ESC4  Connector  [FP_CONN3_TUSKE_254MM]
PA1  Connector  [FP_CONN4_TUSKE_254MM]
PB1  Connector  [FP_CONN4_TUSKE_254MM]
PB2  Connector  [FP_CONN4_TUSKE_254MM]
PB3  Connector  [FP_CONN4_TUSKE_254MM]
PC  Connector  [FP_CONN2_TUSKE_254MM]
PC1  Connector  [FP_CONN4_TUSKE_254MM]
PC2  Connector  [FP_CONN4_TUSKE_254MM]
PC3  Connector  [FP_CONN4_TUSKE_254MM]
PD1  Connector  [FP_CONN4_TUSKE_254MM]
PD2  Connector  [FP_CONN4_TUSKE_254MM]
PD3  Connector  [FP_CONN4_TUSKE_254MM]
PE1  Connector  [FP_CONN4_TUSKE_254MM]
PE2  Connector  [FP_CONN4_TUSKE_254MM]
PE3  Connector  [FP_CONN4_TUSKE_254MM]
PESP1  Connector  [FP_CONN4_TUSKE_254MM]
PESP2  Connector  [FP_CONN4_TUSKE_254MM]
PESP3  Connector  [FP_CONN4_TUSKE_254MM]
PESP4  Connector  [FP_CONN4_TUSKE_254MM]
PESP5  Connector  [FP_CONN4_TUSKE_254MM]
PESP6  Connector  [FP_CONN4_TUSKE_254MM]
PESP7  Connector  [FP_CONN4_TUSKE_254MM]
PESP8  Connector  [FP_CONN2_TUSKE_254MM]
PH1  Connector  [FP_CONN2_TUSKE_254MM]
R3  10K  [FP_0805_RES]
R4  5.1K  [FP_0805_RES]
R5  5.1K  [FP_0805_RES]
SENS  Connector  [FP_CONN3_TUSKE_254MM]
SERV  Connector  [FP_CONN3_TUSKE_254MM]
USB  USB4056-03-A  [USB4056-03-A_REVA2]

### Ports
BOOT0 (out), ESP32_CLK, ESP32_CMD, ESP32_EN, ESP32_P0, ESP32_P2, ESP32_P4, ESP32_P5, ESP32_P16, ESP32_P17, ESP32_P18, ESP32_P19, ESP32_P21, ESP32_P22, ESP32_P23, ESP32_P25, ESP32_P26, ESP32_P27, ESP32_P32, ESP32_P33, ESP32_P34, ESP32_P35, ESP32_RX, ESP32_SD0, ESP32_SD1, ESP32_SD2, ESP32_SD3, ESP32_SVN, ESP32_SVP, ESP32_TX, GPIO_PA3 (bidir), GPIO_PA8 (bidir), GPIO_PA9 (bidir), GPIO_PA10 (bidir), GPIO_PA11 (bidir), GPIO_PA12 (bidir), GPIO_PA15 (bidir), GPIO_PB0 (bidir), GPIO_PB1 (bidir), GPIO_PB2 (bidir), GPIO_PB4 (bidir), GPIO_PB5 (bidir), GPIO_PB9 (bidir), GPIO_PB10 (bidir), GPIO_PB11 (bidir), GPIO_PB12 (bidir), GPIO_PC0 (bidir), GPIO_PC1 (bidir), GPIO_PC2 (bidir), GPIO_PC3 (bidir), GPIO_PC4 (bidir), GPIO_PC5 (bidir), GPIO_PC7 (bidir), GPIO_PC8 (bidir), GPIO_PC9 (bidir), GPIO_PC12 (bidir), GPIO_PC13 (bidir), GPIO_PC14 (bidir), GPIO_PC15 (bidir), GPIO_PD0 (bidir), GPIO_PD1 (bidir), GPIO_PD2 (bidir), GPIO_PD3 (bidir), GPIO_PD4 (bidir), GPIO_PD7 (bidir), GPIO_PD10 (bidir), GPIO_PD11 (bidir), GPIO_PD12 (bidir), GPIO_PD13 (bidir), GPIO_PD14 (bidir), GPIO_PE0 (bidir), GPIO_PE1 (bidir), GPIO_PE2 (bidir), GPIO_PE3 (bidir), GPIO_PE4 (bidir), GPIO_PE5 (bidir), GPIO_PE6 (bidir), GPIO_PE7 (bidir), GPIO_PE8 (bidir), GPIO_PE10 (bidir), GPIO_PE12 (bidir), GPIO_PH0 (bidir), GPIO_PH1 (bidir), NRST (out), SWCLK (out), SWDIO (bidir), SWO (bidir), TIM1_ESC1_CH1 (in), TIM1_ESC2_CH2 (in), TIM1_ESC3_CH3 (in), TIM1_ESC4_CH4 (in), UART2_IBUS_RX (out), UART2_IBUS_TX (in), UART3_PC_RX (out), UART3_PC_TX (in)

### Nets
3.3V: BOOT0.1
5V: C18.2 D3.K(CATHODE) SENS.2 SERV.2
GND: BOOT0.3 C18.1 D1.A D2.A D4.A D5.A D6.A ESC1.1 ESC2.1 ESC3.1 ESC4.1 PE3.4 PESP8.2 R4.1 R5.1 SENS.1 SERV.1 USB.A1(GND_1) USB.A12(GND_2) USB.B1(GND_3) USB.B12(GND_4) USB.MH1 USB.MH2 USB.MH3 USB.MH4
CC1: D5.K R4.2 USB.A5(CC1)
CC2: D6.K R5.2 USB.B5(CC2)
NRST: USB.A10(SSRXN2) USB.B10(SSRXN1) ; port NRST
SWCLK: USB.A3(SSTXN1) USB.B3(SSTXN2) ; port SWCLK
SWDIO: USB.A2(SSTXP1) USB.B2(SSTXP2) ; port SWDIO
SWO: USB.A11(SSRXP2) USB.B11(SSRXP1) ; port SWO
UART3_PC_RX: D2.K PC.2 USB.A7(DN1) USB.B7(DN2) ; port UART3_PC_RX
UART3_PC_TX: D1.K PC.1 USB.A6(DP1) USB.B6(DP2) ; port UART3_PC_TX
VBUS: D3.A(ANODE) D4.K USB.A4(VBUS_1) USB.A9(VBUS_2) USB.B4(VBUS_3) USB.B9(VBUS_4)
NetBOOT0_2: BOOT0.2 R3.1
NetESC1_3: ESC1.3 ; port TIM1_ESC1_CH1
NetESC2_3: ESC2.3 ; port TIM1_ESC2_CH2
NetESC3_3: ESC3.3 ; port TIM1_ESC3_CH3
NetESC4_3: ESC4.3 ; port TIM1_ESC4_CH4
NetESP32_2: PESP1.1 ; port ESP32_EN
NetESP32_3: PESP7.4 ; port ESP32_SVP
NetESP32_4: PESP8.1 ; port ESP32_SVN
NetESP32_5: PESP7.2 ; port ESP32_P34
NetESP32_6: PESP7.3 ; port ESP32_P35
NetESP32_7: PESP6.4 ; port ESP32_P32
NetESP32_8: PESP7.1 ; port ESP32_P33
NetESP32_9: PESP6.1 ; port ESP32_P25
NetESP32_10: PESP6.2 ; port ESP32_P26
NetESP32_11: PESP6.3 ; port ESP32_P27
NetESP32_16: PESP3.3 ; port ESP32_SD2
NetESP32_17: PESP3.4 ; port ESP32_SD3
NetESP32_18: PESP4.1 ; port ESP32_CMD
NetESP32_21: PESP5.4 ; port ESP32_P23
NetESP32_22: PESP5.3 ; port ESP32_P22
NetESP32_23: PESP1.3 ; port ESP32_TX
NetESP32_24: PESP2.1 ; port ESP32_RX
NetESP32_25: PESP5.2 ; port ESP32_P21
NetESP32_27: PESP5.1 ; port ESP32_P19
NetESP32_28: PESP4.4 ; port ESP32_P18
NetESP32_29: PESP2.3 ; port ESP32_P5
NetESP32_30: PESP4.3 ; port ESP32_P17
NetESP32_31: PESP4.2 ; port ESP32_P16
NetESP32_32: PESP2.2 ; port ESP32_P4
NetESP32_33: PESP1.2 ; port ESP32_P0
NetESP32_34: PESP1.4 ; port ESP32_P2
NetESP32_36: PESP3.2 ; port ESP32_SD1
NetESP32_37: PESP3.1 ; port ESP32_SD0
NetESP32_38: PESP2.4 ; port ESP32_CLK
NetPA1_1: PA1.1 ; port GPIO_PA3
NetPA1_2: PA1.2 ; port GPIO_PA8
NetPA1_3: PA1.3 ; port GPIO_PA9
NetPA1_4: PA1.4 ; port GPIO_PA10
NetPB1_1: PB1.1 ; port GPIO_PA11
NetPB1_2: PB1.2 ; port GPIO_PA12
NetPB1_3: PB1.3 ; port GPIO_PA15
NetPB1_4: PB1.4 ; port GPIO_PB0
NetPB2_1: PB2.1 ; port GPIO_PB1
NetPB2_2: PB2.2 ; port GPIO_PB2
NetPB2_3: PB2.3 ; port GPIO_PB4
NetPB2_4: PB2.4 ; port GPIO_PB5
NetPB3_1: PB3.1 ; port GPIO_PB9
NetPB3_2: PB3.2 ; port GPIO_PB10
NetPB3_3: PB3.3 ; port GPIO_PB11
NetPB3_4: PB3.4 ; port GPIO_PB12
NetPC1_1: PC1.1 ; port GPIO_PC0
NetPC1_2: PC1.2 ; port GPIO_PC1
NetPC1_3: PC1.3 ; port GPIO_PC2
NetPC1_4: PC1.4 ; port GPIO_PC3
NetPC2_1: PC2.1 ; port GPIO_PC4
NetPC2_2: PC2.2 ; port GPIO_PC5
NetPC2_3: PC2.3 ; port GPIO_PC7
NetPC2_4: PC2.4 ; port GPIO_PC8
NetPC3_1: PC3.1 ; port GPIO_PC9
NetPC3_2: PC3.2 ; port GPIO_PC12
NetPC3_3: PC3.3 ; port GPIO_PC13
NetPC3_4: PC3.4 ; port GPIO_PC14
NetPD1_1: PD1.1 ; port GPIO_PC15
NetPD1_2: PD1.2 ; port GPIO_PD0
NetPD1_3: PD1.3 ; port GPIO_PD1
NetPD1_4: PD1.4 ; port GPIO_PD2
NetPD2_1: PD2.1 ; port GPIO_PD3
NetPD2_2: PD2.2 ; port GPIO_PD4
NetPD2_3: PD2.3 ; port GPIO_PD7
NetPD2_4: PD2.4 ; port GPIO_PD10
NetPD3_1: PD3.1 ; port GPIO_PD11
NetPD3_2: PD3.2 ; port GPIO_PD12
NetPD3_3: PD3.3 ; port GPIO_PD13
NetPD3_4: PD3.4 ; port GPIO_PD14
NetPE1_1: PE1.1 ; port GPIO_PE0
NetPE1_2: PE1.2 ; port GPIO_PE1
NetPE1_3: PE1.3 ; port GPIO_PE2
NetPE1_4: PE1.4 ; port GPIO_PE3
NetPE2_1: PE2.1 ; port GPIO_PE4
NetPE2_2: PE2.2 ; port GPIO_PE5
NetPE2_3: PE2.3 ; port GPIO_PE6
NetPE2_4: PE2.4 ; port GPIO_PE7
NetPE3_1: PE3.1 ; port GPIO_PE8
NetPE3_2: PE3.2 ; port GPIO_PE10
NetPE3_3: PE3.3 ; port GPIO_PE12
NetPH1_1: PH1.1 ; port GPIO_PH0
NetPH1_2: PH1.2 ; port GPIO_PH1
NetR3_2: R3.2 ; port BOOT0
NetSENS_3: SENS.3 ; port UART2_IBUS_TX
NetSERV_3: SERV.3 ; port UART2_IBUS_RX

Not connected (* = marked no-connect by the designer): ESC1 2*; ESC2 2*; ESC3 2*; ESC4 2*; USB A8(SBU1)* B8(SBU2)*

### Library data of the parts
BOOT0 ESC1-ESC4 SENS SERV = Connector_3pin: 3pin connector
C18 = CAP: Capacitor; Value: 100nF
D1 D2 D4-D6 = ZENER: Zener Diode
D3 = SCHOTTKY: Schottky diode
PA1 PB1-PB3 PC1-PC3 PD1-PD3 PE1-PE3 PESP1-PESP7 = Connector_4pin: 4pin Connector
PC PESP8 PH1 = Connector_2pin: 2pin connector
R3-R5 = RES: Resistor
  R3: Value: 10K
  R4 R5: Value: 5.1K
USB = USB4056-03-A: USB Connectors USB C 3.2 Rec, Horz, Hybrid PCB Top Mount, T+R; Manufacturer_Name: GCT (GLOBAL CONNECTOR TECHNOLOGY); Geometry.Height: 3.56mm; Mouser Part Number: 640-USB4056-03-A; Mouser Price/Stock: https://www.mouser.co.uk/ProductDetail/GCT/USB4056-03-A?qs=QNEnbhJQKvbZ7hZzgFEugA%3D%3D; Manufacturer_Part_Number: USB4056-03-A; Datasheet Link: https://www.mouser.jp/datasheet/2/837/usb4056-2448808.pdf

## Sheet PowerAndSafety.SchDoc
size A4; SheetNumber: 5; SheetTotal: 5
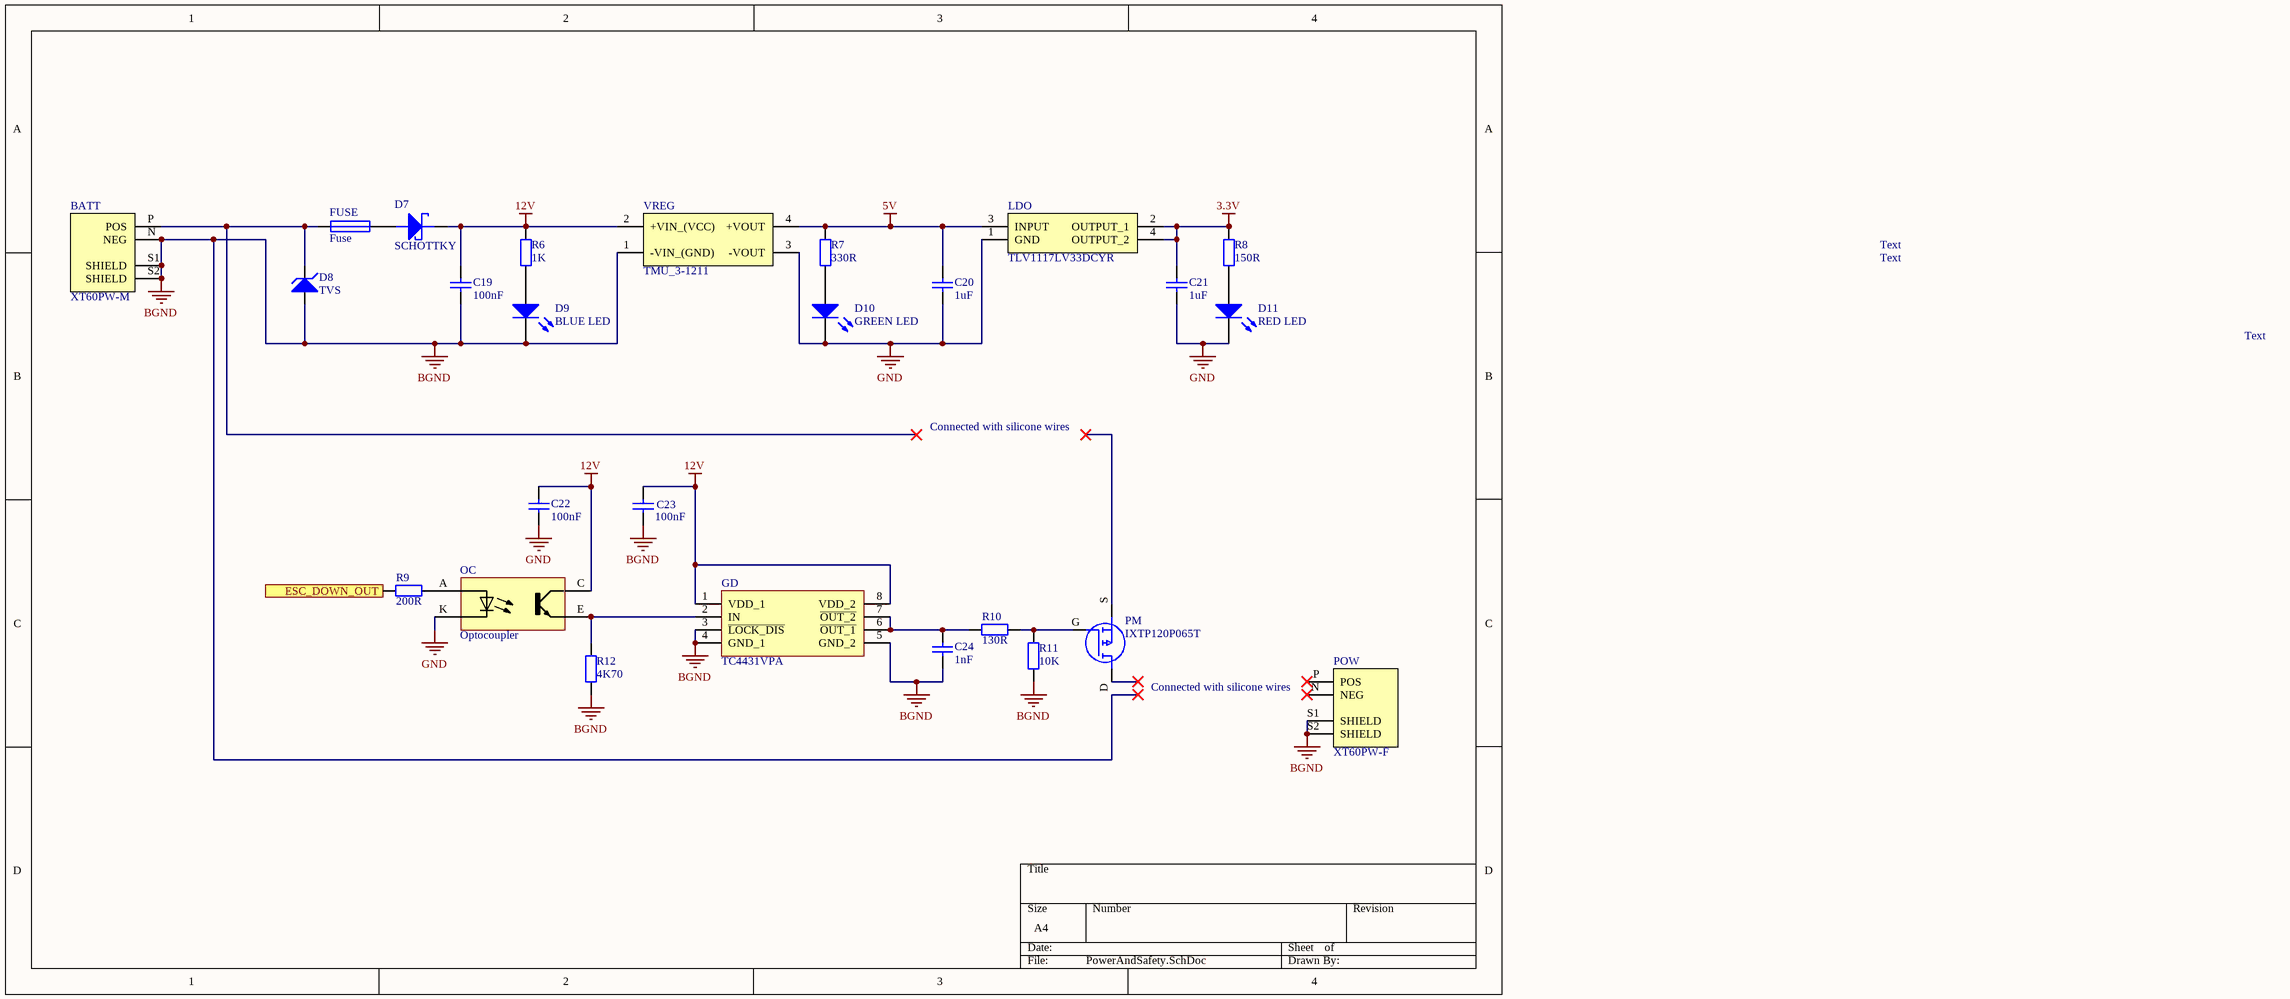
[diagram p4: PowerAndSafety.SchDoc]

### Parts
BATT  XT60PW-M  [AMASS_XT60PW-M]
C19  100nF  [FP_0805_CAP_085]
C20  1uF  [FP_0805_CAP_085]
C21  1uF  [FP_0805_CAP_085]
C22  100nF  [FP_0805_CAP_085]
C23  100nF  [FP_0805_CAP_085]
C24  1nF  [FP_0805_CAP_085]
D7  SCHOTTKY  [FP_SMA]
D8  TVS  [FP_SMB]
D9  BLUE LED  [LED_SMD_0805_BLUE]
D10  GREEN LED  [LED_SMD_0805_GREEN]
D11  RED LED  [LED_SMD_0805_RED]
FUSE  Fuse  [ECE BU110 PolyFuse]
GD  TC4431VPA  [DIP781W56P254L950H533Q8N]
LDO  TLV1117LV33DCYR  [SOT230P700X180-4N]
OC  Optocoupler  [SOP254P1016X400-4N]
PM  IXTP120P065T  [TO254P483X1028X2284-3P - extended]
POW  XT60PW-F  [AMASS_XT60PW-F]
R6  1K  [FP_0805_RES]
R7  330R  [FP_0805_RES]
R8  150R  [FP_0805_RES]
R9  200R  [FP_0805_RES]
R10  130R  [FP_0805_RES]
R11  10K  [FP_0805_RES]
R12  4K70  [FP_0805_RES]
VREG  TMU_3-1211  [TMU31211]

### Ports
ESC_DOWN_OUT (in)

### Nets
3.3V: C21.2 LDO.2(OUTPUT_1) LDO.4(OUTPUT_2) R8.2
5V: C20.2 LDO.3(INPUT) R7.2 VREG.4(+VOUT)
12V: C19.2 C22.1 C23.1 D7.K(CATHODE) GD.1(VDD_1) GD.8(VDD_2) OC.C R6.2 VREG.2(+VIN_(VCC))
BGND: BATT.N(NEG) BATT.S1(SHIELD) BATT.S2(SHIELD) C19.1 C23.2 C24.1 D8.A D9.K GD.3(~{LOCK_DIS}) GD.4(GND_1) GD.5(GND_2) POW.S1(SHIELD) POW.S2(SHIELD) R11.1 R12.1 VREG.1(-VIN_(GND))
GND: C20.1 C21.1 C22.2 D10.K D11.K LDO.1(GND) OC.K VREG.3(-VOUT)
NetBATT_P: BATT.P(POS) D8.K FUSE.1
NetC24_2: C24.2 GD.6(~{OUT_1}) GD.7(~{OUT_2}) R10.1
NetD7_A: D7.A(ANODE) FUSE.2
NetD9_A: D9.A R6.1
NetD10_A: D10.A R7.1
NetD11_A: D11.A R8.1
NetGD_2: GD.2(IN) OC.E R12.2
NetOC_A: OC.A R9.1
NetPM_G: PM.G(Gate) R10.2 R11.2
NetR9_2: R9.2 ; port ESC_DOWN_OUT

Not connected (* = marked no-connect by the designer): PM D(Drain)* S(Source)*; POW N(NEG)* P(POS)*

### Notes on the sheet
- Text
- Connected with silicone wires
- (near POW) Connected with silicone wires

### Library data of the parts
BATT = XT60PW-M: Socket, DC supply, male, PIN: 2; MF: AMASS; Check_prices: https://www.snapeda.com/parts/XT60PW-M/AMASS/view-part/?ref=eda; SnapEDA_Link: https://www.snapeda.com/parts/XT60PW-M/AMASS/view-part/?ref=snap; Price: None; Availability: Not in stock; Package: Package; MP: XT60PW-M; Value: *
C19-C24 = CAP: Capacitor
  C19 C22 C23: Value: 100nF
  C20 C21: Value: 1uF
  C24: Value: 1nF
D7 = SCHOTTKY: Schottky diode
D8 = ZENER: TVS Diode
D9-D11 = LED: Typical RED GaAs LED
GD = TC4431VPA: Microchip TC4431VPA, MOSFET Power Driver 1.5A, 4.5  30 V, Inverting, 8-Pin PDIP; Geometry.Height: 5.334mm; Mouser Part Number: 579-TC4431VPA; Mouser Price/Stock: https://www.mouser.co.uk/ProductDetail/Microchip-Technology/TC4431VPA?qs=dJbzCyn%252BCFb0mSWY4MWPfw%3D%3D; Manufacturer_Name: Microchip; Manufacturer_Part_Number: TC4431VPA; Datasheet Link: http://ww1.microchip.com/downloads/en/DeviceDoc/21424d.pdf
LDO = TLV1117LV33DCYR: 1-A, Positive Fixed Voltage, Low-Dropout Regulator; Manufacturer_Name: Texas Instruments; Geometry.Height: 1.8mm; Mouser Part Number: 595-TLV1117LV33DCYR; Mouser Price/Stock: https://www.mouser.co.uk/ProductDetail/Texas-Instruments/TLV1117LV33DCYR?qs=tEz3BkPb1rwzXMb8FiWhow%3D%3D; Manufacturer_Part_Number: TLV1117LV33DCYR; Datasheet Link: http://www.ti.com/lit/gpn/tlv1117lv
OC = Optocoupler: pin to pad: A>1 C>4 E>3 K>2; MP: VO615A-9X009T; Package: None; Price: None; Value: *; Availability: Unavailable
PM = IXTP120P065T: POWER MOSFET -120 Amps -65V 0.01 Rds; Manufacturer_Name: LITTELFUSE; Geometry.Height: 4.83mm; Mouser Part Number: 747-IXTP120P065T; Mouser Price/Stock: https://www.mouser.co.uk/ProductDetail/IXYS/IXTP120P065T?qs=cvHLLyFtoE09fNdm%2Fv8mrw%3D%3D; Manufacturer_Part_Number: IXTP120P065T; Datasheet Link: https://m.littelfuse.com/~/media/electronics/datasheets/discrete_mosfets/littelfuse_discrete_mosfets_p-channel_ixt_120p065t_datasheet.pdf.pdf
POW = XT60PW-F: Socket DC Supply Connector Female; MF: AMASS; SnapEDA_Link: https://www.snapeda.com/parts/XT60PW-F/AMASS/view-part/?ref=snap; Package: Package; Availability: Not in stock; Price: None; Check_prices: https://www.snapeda.com/parts/XT60PW-F/AMASS/view-part/?ref=eda; MP: XT60PW-F; Value: *
R6-R12 = RES: Resistor
  R6: Value: 1K
  R7: Value: 330R
  R8: Value: 150R
  R9: Value: 200R
  R10: Value: 130R
  R11: Value: 10K
  R12: Value: 4K70
VREG = TMU_3-1211: 3 Watt DC/DC converter, industrial, +/-10% input, short circuit protection, unregulated, encapsulated, SIP-4; Manufacturer_Name: Traco Power; Manufacturer_Part_Number: TMU 3-1211; Geometry.Height: 10.7mm; Mouser Part Number: 495-TMU3-1211; Mouser Price/Stock: https://www.mouser.co.uk/ProductDetail/TRACO-Power/TMU-3-1211?qs=By6Nw2ByBD3GesUHA2ql3Q%3D%3D; Datasheet Link: https://tracopower.com/tmu3-datasheet/

## Nets that join several sheets
3.3V: STM_ESP (17 pins), Sensors (C14.2 IMU.2 LC.1), Connectors (BOOT0.1), PowerAndSafety (C21.2 LDO.2 LDO.4 R8.2)
5V: STM_ESP (C12.2 ESP32.19), Sensors (9 pins), Connectors (C18.2 D3.K SENS.2 SERV.2), PowerAndSafety (C20.2 LDO.3 R7.2 VREG.4)
GND: STM_ESP (23 pins), Sensors (11 pins), Connectors (25 pins), PowerAndSafety (8 pins)
NetESC1_3: STM_ESP (STM32.39), Connectors (ESC1.3)
NetESC2_3: STM_ESP (STM32.41), Connectors (ESC2.3)
NetESC3_3: STM_ESP (STM32.43), Connectors (ESC3.3)
NetESC4_3: STM_ESP (STM32.44), Connectors (ESC4.3)
NetESP32_2: STM_ESP (ESP32.2), Connectors (PESP1.1)
NetESP32_3: STM_ESP (ESP32.3), Connectors (PESP7.4)
NetESP32_4: STM_ESP (ESP32.4), Connectors (PESP8.1)
NetESP32_5: STM_ESP (ESP32.5), Connectors (PESP7.2)
NetESP32_6: STM_ESP (ESP32.6), Connectors (PESP7.3)
NetESP32_7: STM_ESP (ESP32.7), Connectors (PESP6.4)
NetESP32_8: STM_ESP (ESP32.8), Connectors (PESP7.1)
NetESP32_9: STM_ESP (ESP32.9), Connectors (PESP6.1)
NetESP32_10: STM_ESP (ESP32.10), Connectors (PESP6.2)
NetESP32_11: STM_ESP (ESP32.11), Connectors (PESP6.3)
NetESP32_16: STM_ESP (ESP32.16), Connectors (PESP3.3)
NetESP32_17: STM_ESP (ESP32.17), Connectors (PESP3.4)
NetESP32_18: STM_ESP (ESP32.18), Connectors (PESP4.1)
NetESP32_21: STM_ESP (ESP32.21), Connectors (PESP5.4)
NetESP32_22: STM_ESP (ESP32.22), Connectors (PESP5.3)
NetESP32_23: STM_ESP (ESP32.23), Connectors (PESP1.3)
NetESP32_24: STM_ESP (ESP32.24), Connectors (PESP2.1)
NetESP32_25: STM_ESP (ESP32.25), Connectors (PESP5.2)
NetESP32_27: STM_ESP (ESP32.27), Connectors (PESP5.1)
NetESP32_28: STM_ESP (ESP32.28), Connectors (PESP4.4)
NetESP32_29: STM_ESP (ESP32.29), Connectors (PESP2.3)
NetESP32_30: STM_ESP (ESP32.30), Connectors (PESP4.3)
NetESP32_31: STM_ESP (ESP32.31), Connectors (PESP4.2)
NetESP32_32: STM_ESP (ESP32.32), Connectors (PESP2.2)
NetESP32_33: STM_ESP (ESP32.33), Connectors (PESP1.2)
NetESP32_34: STM_ESP (ESP32.34), Connectors (PESP1.4)
NetESP32_36: STM_ESP (ESP32.36), Connectors (PESP3.2)
NetESP32_37: STM_ESP (ESP32.37), Connectors (PESP3.1)
NetESP32_38: STM_ESP (ESP32.38), Connectors (PESP2.4)
NetGPS_3: STM_ESP (STM32.22), Sensors (GPS.3)
NetGPS_4: STM_ESP (STM32.23), Sensors (GPS.4)
NetGPS_5: STM_ESP (STM32.24), Sensors (GPS.5)
NetIMU_4: STM_ESP (STM32.52), Sensors (IMU.4)
NetIMU_5: STM_ESP (STM32.54), Sensors (IMU.5)
NetIMU_6: STM_ESP (STM32.53), Sensors (IMU.6)
NetIMU_7: STM_ESP (STM32.55), Sensors (IMU.7)
NetIMU_8: STM_ESP (STM32.56), Sensors (IMU.8)
NetLC_3: STM_ESP (STM32.62), Sensors (LC.3)
NetLC_4: STM_ESP (STM32.63), Sensors (LC.4)
NetMAG_3: STM_ESP (STM32.92), Sensors (MAG.3)
NetMAG_4: STM_ESP (STM32.93), Sensors (MAG.4)
NetMAG_5: STM_ESP (STM32.95), Sensors (MAG.5)
NetPA1_1: STM_ESP (STM32.25), Connectors (PA1.1)
NetPA1_2: STM_ESP (STM32.67), Connectors (PA1.2)
NetPA1_3: STM_ESP (STM32.68), Connectors (PA1.3)
NetPA1_4: STM_ESP (STM32.69), Connectors (PA1.4)
NetPB1_1: STM_ESP (STM32.70), Connectors (PB1.1)
NetPB1_2: STM_ESP (STM32.71), Connectors (PB1.2)
NetPB1_3: STM_ESP (STM32.77), Connectors (PB1.3)
NetPB1_4: STM_ESP (STM32.34), Connectors (PB1.4)
NetPB2_1: STM_ESP (STM32.35), Connectors (PB2.1)
NetPB2_2: STM_ESP (STM32.36), Connectors (PB2.2)
NetPB2_3: STM_ESP (STM32.90), Connectors (PB2.3)
NetPB2_4: STM_ESP (STM32.91), Connectors (PB2.4)
NetPB3_1: STM_ESP (STM32.96), Connectors (PB3.1)
NetPB3_2: STM_ESP (STM32.46), Connectors (PB3.2)
NetPB3_3: STM_ESP (STM32.47), Connectors (PB3.3)
NetPB3_4: STM_ESP (STM32.51), Connectors (PB3.4)
NetPC1_1: STM_ESP (STM32.15), Connectors (PC1.1)
NetPC1_2: STM_ESP (STM32.16), Connectors (PC1.2)
NetPC1_3: STM_ESP (STM32.17), Connectors (PC1.3)
NetPC1_4: STM_ESP (STM32.18), Connectors (PC1.4)
NetPC2_1: STM_ESP (STM32.32), Connectors (PC2.1)
NetPC2_2: STM_ESP (STM32.33), Connectors (PC2.2)
NetPC2_3: STM_ESP (STM32.64), Connectors (PC2.3)
NetPC2_4: STM_ESP (STM32.65), Connectors (PC2.4)
NetPC3_1: STM_ESP (STM32.66), Connectors (PC3.1)
NetPC3_2: STM_ESP (STM32.80), Connectors (PC3.2)
NetPC3_3: STM_ESP (STM32.7), Connectors (PC3.3)
NetPC3_4: STM_ESP (STM32.8), Connectors (PC3.4)
NetPD1_1: STM_ESP (STM32.9), Connectors (PD1.1)
NetPD1_2: STM_ESP (STM32.81), Connectors (PD1.2)
NetPD1_3: STM_ESP (STM32.82), Connectors (PD1.3)
NetPD1_4: STM_ESP (STM32.83), Connectors (PD1.4)
NetPD2_1: STM_ESP (STM32.84), Connectors (PD2.1)
NetPD2_2: STM_ESP (STM32.85), Connectors (PD2.2)
NetPD2_3: STM_ESP (STM32.88), Connectors (PD2.3)
NetPD2_4: STM_ESP (STM32.57), Connectors (PD2.4)
NetPD3_1: STM_ESP (STM32.58), Connectors (PD3.1)
NetPD3_2: STM_ESP (STM32.59), Connectors (PD3.2)
NetPD3_3: STM_ESP (STM32.60), Connectors (PD3.3)
NetPD3_4: STM_ESP (STM32.61), Connectors (PD3.4)
NetPE1_1: STM_ESP (STM32.97), Connectors (PE1.1)
NetPE1_2: STM_ESP (STM32.98), Connectors (PE1.2)
NetPE1_3: STM_ESP (STM32.1), Connectors (PE1.3)
NetPE1_4: STM_ESP (STM32.2), Connectors (PE1.4)
NetPE2_1: STM_ESP (STM32.3), Connectors (PE2.1)
NetPE2_2: STM_ESP (STM32.4), Connectors (PE2.2)
NetPE2_3: STM_ESP (STM32.5), Connectors (PE2.3)
NetPE2_4: STM_ESP (STM32.37), Connectors (PE2.4)
NetPE3_1: STM_ESP (STM32.38), Connectors (PE3.1)
NetPE3_2: STM_ESP (STM32.40), Connectors (PE3.2)
NetPE3_3: STM_ESP (STM32.42), Connectors (PE3.3)
NetPH1_1: STM_ESP (STM32.12), Connectors (PH1.1)
NetPH1_2: STM_ESP (STM32.13), Connectors (PH1.2)
NetR3_2: STM_ESP (STM32.94), Connectors (R3.2)
NetR9_2: STM_ESP (STM32.45), PowerAndSafety (R9.2)
NetSENS_3: STM_ESP (STM32.86), Connectors (SENS.3)
NetSERV_3: STM_ESP (STM32.87), Connectors (SERV.3)
NRST: STM_ESP (PRST.3), Connectors (USB.A10 USB.B10)
SWCLK: STM_ESP (STM32.76), Connectors (USB.A3 USB.B3)
SWDIO: STM_ESP (STM32.72), Connectors (USB.A2 USB.B2)
SWO: STM_ESP (STM32.89), Connectors (USB.A11 USB.B11)
UART3_PC_RX: STM_ESP (STM32.79), Connectors (D2.K PC.2 USB.A7 USB.B7)
UART3_PC_TX: STM_ESP (STM32.78), Connectors (D1.K PC.1 USB.A6 USB.B6)